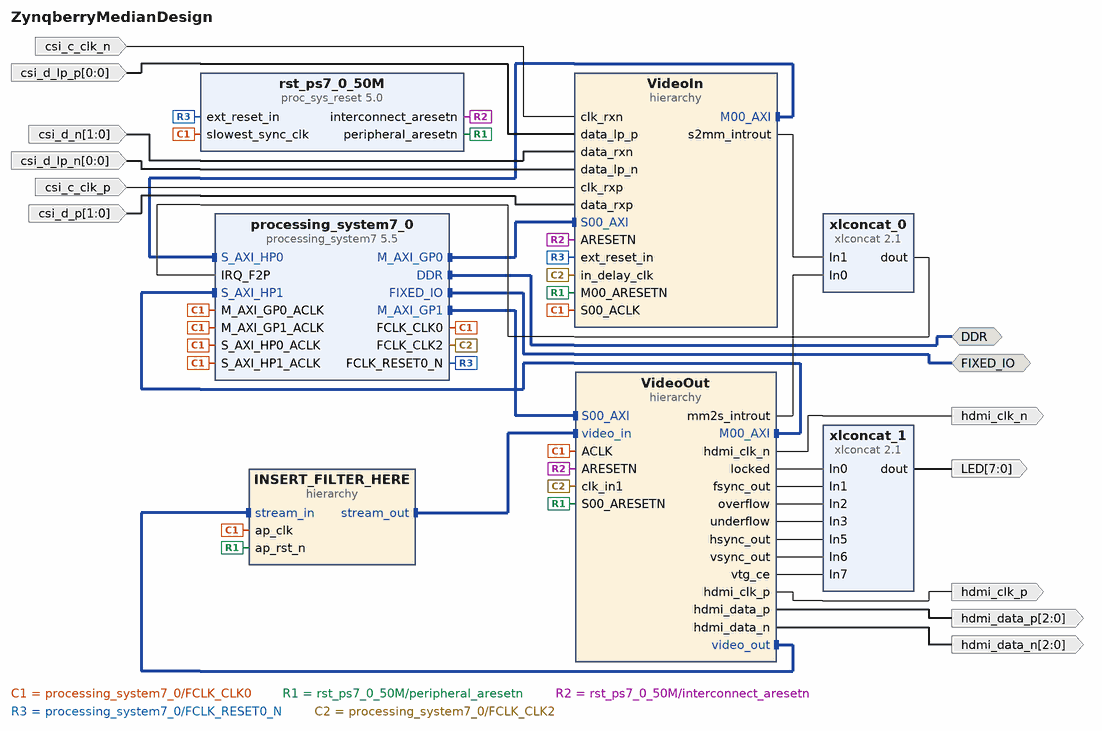
[diagram p0: block diagram of the top level]
# Vivado block design ZynqberryMedianDesign, xc7z010clg225-1, Vivado 2017.2
create_bd_design ZynqberryMedianDesign

create_bd_intf_port -mode Master -vlnv xilinx.com:interface:ddrx_rtl:1.0 DDR
create_bd_intf_port -mode Master -vlnv xilinx.com:display_processing_system7:fixedio_rtl:1.0 FIXED_IO
create_bd_port -dir O -from 2 -to 0 hdmi_data_p
create_bd_port -dir O hdmi_clk_p
create_bd_port -dir O hdmi_clk_n
create_bd_port -dir O -from 2 -to 0 hdmi_data_n
create_bd_port -dir O -from 7 -to 0 LED
create_bd_port -dir I csi_c_clk_n
create_bd_port -dir I -from 0 -to 0 csi_d_lp_p
create_bd_port -dir I -from 1 -to 0 csi_d_n
create_bd_port -dir I -from 0 -to 0 csi_d_lp_n
create_bd_port -dir I csi_c_clk_p
create_bd_port -dir I -from 1 -to 0 csi_d_p

create_bd_cell -type ip -vlnv xilinx.com:ip:processing_system7:5.5 processing_system7_0
set_property -dict [list \
  CONFIG.PCW_FCLK_CLK1_BUF TRUE \
  CONFIG.PCW_SDIO_PERIPHERAL_FREQMHZ 50 \
  CONFIG.PCW_I2C_PERIPHERAL_FREQMHZ 111.111115 \
  CONFIG.PCW_FPGA0_PERIPHERAL_FREQMHZ 150 \
  CONFIG.PCW_FPGA1_PERIPHERAL_FREQMHZ 100 \
  CONFIG.PCW_FPGA2_PERIPHERAL_FREQMHZ 200 \
  CONFIG.PCW_USE_M_AXI_GP1 1 \
  CONFIG.PCW_USE_S_AXI_HP0 1 \
  CONFIG.PCW_USE_S_AXI_HP1 1 \
  CONFIG.PCW_USE_FABRIC_INTERRUPT 1 \
  CONFIG.PCW_S_AXI_HP0_DATA_WIDTH 32 \
  CONFIG.PCW_S_AXI_HP1_DATA_WIDTH 32 \
  CONFIG.PCW_DQ_WIDTH 16 \
  CONFIG.PCW_DQS_WIDTH 2 \
  CONFIG.PCW_DM_WIDTH 2 \
  CONFIG.PCW_MIO_PRIMITIVE 32 \
  CONFIG.PCW_EN_CLK1_PORT 1 \
  CONFIG.PCW_EN_CLK2_PORT 1 \
  CONFIG.PCW_IRQ_F2P_INTR 1 \
  CONFIG.PCW_UIPARAM_DDR_MEMORY_TYPE {DDR 3 (Low Voltage)} \
  CONFIG.PCW_UIPARAM_DDR_BUS_WIDTH {16 Bit} \
  CONFIG.PCW_UIPARAM_DDR_PARTNO {MT41J256M16 RE-125} \
  CONFIG.PCW_QSPI_PERIPHERAL_ENABLE 1 \
  CONFIG.PCW_QSPI_QSPI_IO {MIO 1 .. 6} \
  CONFIG.PCW_QSPI_GRP_SINGLE_SS_ENABLE 1 \
  CONFIG.PCW_QSPI_GRP_SINGLE_SS_IO {MIO 1 .. 6} \
  CONFIG.PCW_SD1_PERIPHERAL_ENABLE 1 \
  CONFIG.PCW_SD1_SD1_IO {MIO 10 .. 15} \
  CONFIG.PCW_SD1_GRP_CD_ENABLE 1 \
  CONFIG.PCW_SD1_GRP_CD_IO {MIO 0} \
  CONFIG.PCW_UART1_PERIPHERAL_ENABLE 1 \
  CONFIG.PCW_UART1_UART1_IO {MIO 8 .. 9} \
  CONFIG.PCW_TTC0_PERIPHERAL_ENABLE 1 \
  CONFIG.PCW_TTC0_TTC0_IO EMIO \
  CONFIG.PCW_USB0_PERIPHERAL_ENABLE 1 \
  CONFIG.PCW_USB0_USB0_IO {MIO 28 .. 39} \
  CONFIG.PCW_USB_RESET_ENABLE 1 \
  CONFIG.PCW_USB_RESET_SELECT {Share reset pin} \
  CONFIG.PCW_USB0_RESET_ENABLE 1 \
  CONFIG.PCW_USB0_RESET_IO {MIO 7} \
  CONFIG.PCW_I2C1_PERIPHERAL_ENABLE 1 \
  CONFIG.PCW_I2C1_I2C1_IO {MIO 48 .. 49} \
  CONFIG.PCW_I2C1_GRP_INT_ENABLE 1 \
  CONFIG.PCW_I2C1_GRP_INT_IO EMIO \
  CONFIG.PCW_I2C_RESET_ENABLE 1 \
  CONFIG.PCW_I2C_RESET_SELECT {Share reset pin} \
  CONFIG.PCW_GPIO_MIO_GPIO_ENABLE 1 \
  CONFIG.PCW_GPIO_MIO_GPIO_IO MIO \
  CONFIG.PCW_ENET0_PERIPHERAL_CLKSRC External \
  CONFIG.PCW_UIPARAM_GENERATE_SUMMARY NONE \
  CONFIG.PCW_FPGA_FCLK1_ENABLE 1 \
] [get_bd_cells processing_system7_0]
# 142 more settings of processing_system7_0 are not shown: defaults, MIO pin electricals, DDR timing, and values the tool derives
create_bd_cell -type ip -vlnv xilinx.com:ip:proc_sys_reset:5.0 rst_ps7_0_50M
create_bd_cell -type hier VideoOut
create_bd_cell -type ip -vlnv xilinx.com:ip:xlconcat:2.1 xlconcat_0
set_property -dict {CONFIG.NUM_PORTS 2} [get_bd_cells xlconcat_0]
create_bd_cell -type ip -vlnv xilinx.com:ip:xlconcat:2.1 xlconcat_1
set_property -dict {CONFIG.NUM_PORTS 8} [get_bd_cells xlconcat_1]
create_bd_cell -type hier VideoIn
create_bd_cell -type hier INSERT_FILTER_HERE

# ---- hierarchy /VideoOut ----
current_bd_instance /VideoOut
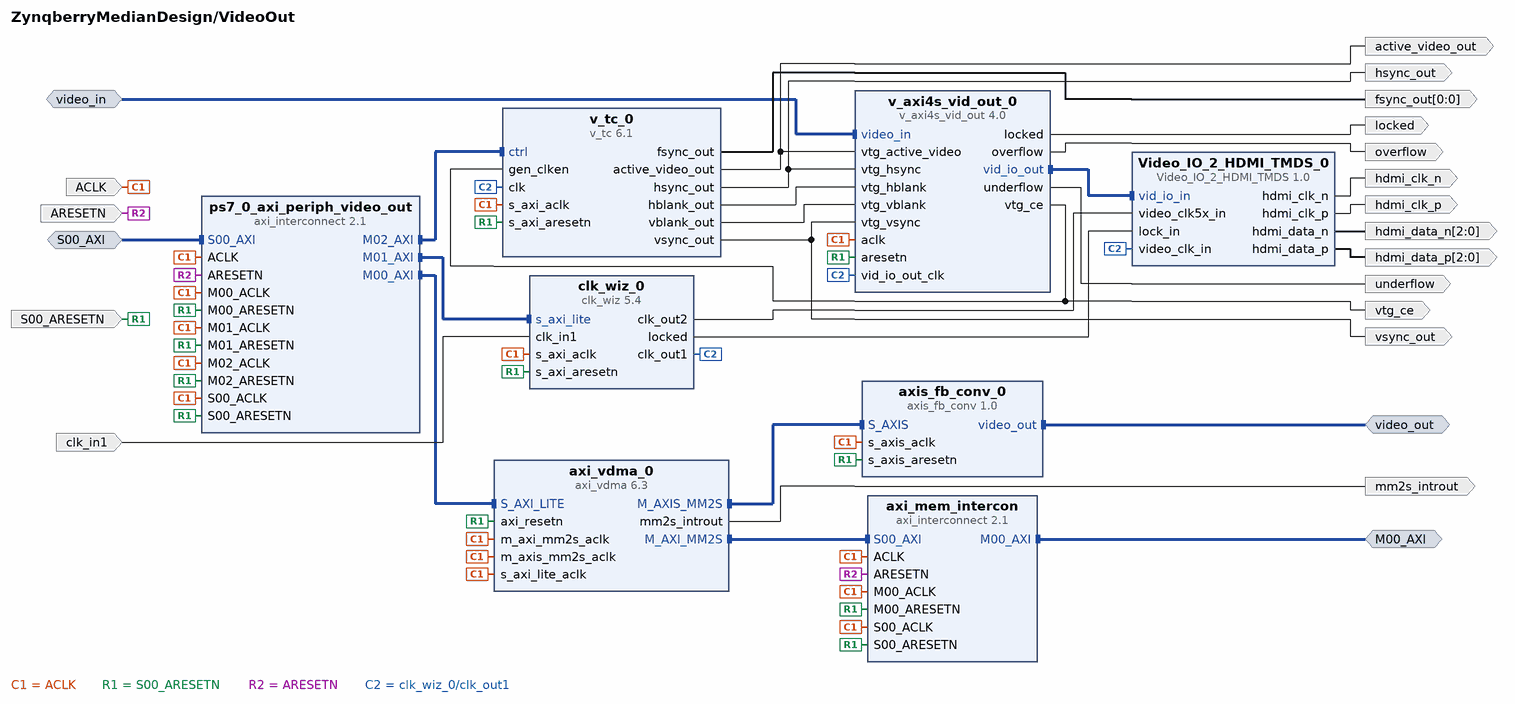
[diagram p1: block diagram inside /VideoOut]
create_bd_intf_pin -mode Slave -vlnv xilinx.com:interface:aximm_rtl:1.0 S00_AXI
create_bd_intf_pin -mode Master -vlnv xilinx.com:interface:aximm_rtl:1.0 M00_AXI
create_bd_intf_pin -mode Slave -vlnv xilinx.com:interface:axis_rtl:1.0 video_in
create_bd_intf_pin -mode Master -vlnv xilinx.com:interface:axis_rtl:1.0 video_out
create_bd_pin -dir I -type clk ACLK
create_bd_pin -dir I -type rst S00_ARESETN
create_bd_pin -dir I -type rst ARESETN
create_bd_pin -dir I -type clk clk_in1
create_bd_pin -dir O -type intr mm2s_introut
create_bd_pin -dir O -from 2 -to 0 hdmi_data_p
create_bd_pin -dir O hdmi_clk_p
create_bd_pin -dir O hdmi_clk_n
create_bd_pin -dir O -from 2 -to 0 hdmi_data_n
create_bd_pin -dir O locked
create_bd_pin -dir O -from 0 -to 0 fsync_out
create_bd_pin -dir O overflow
create_bd_pin -dir O underflow
create_bd_pin -dir O active_video_out
create_bd_pin -dir O hsync_out
create_bd_pin -dir O vsync_out
create_bd_pin -dir O vtg_ce

create_bd_cell -type ip -vlnv xilinx.com:ip:axi_vdma:6.3 axi_vdma_0
set_property -dict [list \
  CONFIG.c_m_axi_mm2s_data_width 32 \
  CONFIG.c_num_fstores 1 \
  CONFIG.c_mm2s_genlock_mode 0 \
  CONFIG.c_mm2s_linebuffer_depth 4096 \
  CONFIG.c_mm2s_max_burst_length 16 \
  CONFIG.c_include_s2mm 0 \
] [get_bd_cells axi_vdma_0]
create_bd_cell -type ip -vlnv xilinx.com:ip:axi_interconnect:2.1 axi_mem_intercon
set_property -dict {CONFIG.NUM_SI 1 CONFIG.NUM_MI 1 CONFIG.ENABLE_ADVANCED_OPTIONS 0} [get_bd_cells axi_mem_intercon]
create_bd_cell -type ip -vlnv xilinx.com:ip:axi_interconnect:2.1 ps7_0_axi_periph_video_out
set_property -dict {CONFIG.NUM_MI 3} [get_bd_cells ps7_0_axi_periph_video_out]
create_bd_cell -type ip -vlnv xilinx.com:ip:clk_wiz:5.4 clk_wiz_0
set_property -dict [list \
  CONFIG.USE_DYN_RECONFIG true \
  CONFIG.JITTER_SEL Min_O_Jitter \
  CONFIG.PRIM_IN_FREQ 200.000 \
  CONFIG.CLKIN1_JITTER_PS 50.0 \
  CONFIG.CLKOUT2_USED true \
  CONFIG.NUM_OUT_CLKS 2 \
  CONFIG.CLKOUT1_REQUESTED_OUT_FREQ 74.250 \
  CONFIG.CLKOUT2_REQUESTED_OUT_FREQ 371.250 \
  CONFIG.MMCM_DIVCLK_DIVIDE 10 \
  CONFIG.MMCM_BANDWIDTH HIGH \
  CONFIG.MMCM_CLKFBOUT_MULT_F 37.125 \
  CONFIG.MMCM_CLKIN1_PERIOD 5.000 \
  CONFIG.MMCM_CLKIN2_PERIOD 10.0 \
  CONFIG.MMCM_CLKOUT0_DIVIDE_F 10.000 \
  CONFIG.MMCM_CLKOUT1_DIVIDE 2 \
  CONFIG.CLKOUT1_JITTER 333.287 \
  CONFIG.CLKOUT1_PHASE_ERROR 322.999 \
  CONFIG.CLKOUT2_JITTER 256.477 \
  CONFIG.CLKOUT2_PHASE_ERROR 322.999 \
] [get_bd_cells clk_wiz_0]
create_bd_cell -type ip -vlnv xilinx.com:ip:v_tc:6.1 v_tc_0
set_property -dict {CONFIG.max_lines_per_frame 2048 CONFIG.enable_detection false} [get_bd_cells v_tc_0]
create_bd_cell -type ip -vlnv xilinx.com:ip:v_axi4s_vid_out:4.0 v_axi4s_vid_out_0
set_property -dict {CONFIG.C_HAS_ASYNC_CLK 1} [get_bd_cells v_axi4s_vid_out_0]
create_bd_cell -type ip -vlnv trenz.biz:user:Video_IO_2_HDMI_TMDS:1.0 Video_IO_2_HDMI_TMDS_0
set_property -dict [list \
  CONFIG.C_CLK_SWAP true \
  CONFIG.C_D0_SWAP true \
  CONFIG.C_INT_CLOCKING false \
] [get_bd_cells Video_IO_2_HDMI_TMDS_0]
create_bd_cell -type ip -vlnv trenz.biz:user:axis_fb_conv:1.0 axis_fb_conv_0

# ---- hierarchy /VideoIn ----
current_bd_instance /VideoIn
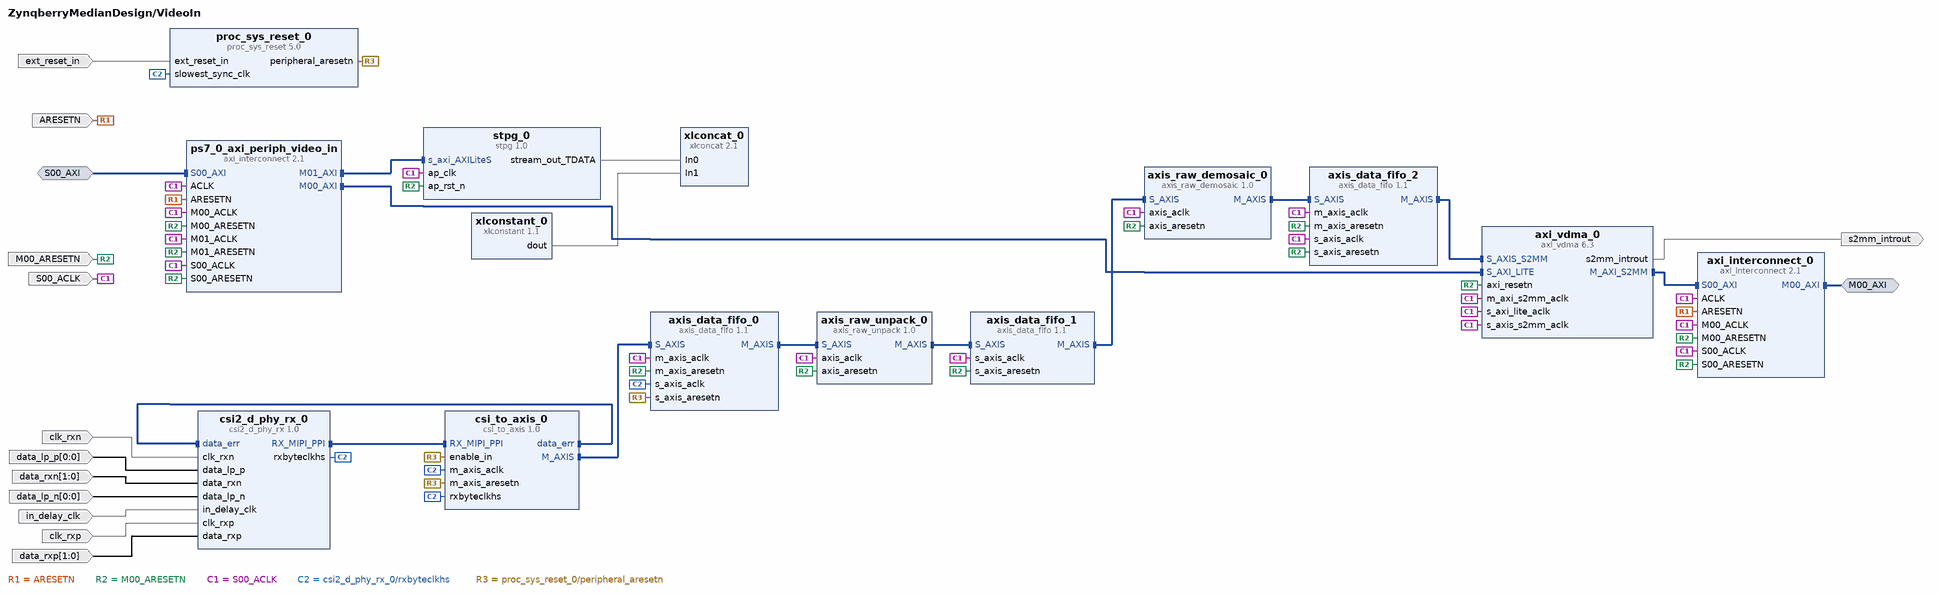
[diagram p2: block diagram inside /VideoIn]
create_bd_intf_pin -mode Slave -vlnv xilinx.com:interface:aximm_rtl:1.0 S00_AXI
create_bd_intf_pin -mode Master -vlnv xilinx.com:interface:aximm_rtl:1.0 M00_AXI
create_bd_pin -dir I -type rst ARESETN
create_bd_pin -dir I -type rst M00_ARESETN
create_bd_pin -dir I -type clk S00_ACLK
create_bd_pin -dir O -type intr s2mm_introut
create_bd_pin -dir I clk_rxn
create_bd_pin -dir I -from 0 -to 0 data_lp_p
create_bd_pin -dir I -from 1 -to 0 data_rxn
create_bd_pin -dir I -from 0 -to 0 data_lp_n
create_bd_pin -dir I -type clk in_delay_clk
create_bd_pin -dir I clk_rxp
create_bd_pin -dir I -from 1 -to 0 data_rxp
create_bd_pin -dir I -type rst ext_reset_in

create_bd_cell -type ip -vlnv xilinx.com:ip:axi_interconnect:2.1 ps7_0_axi_periph_video_in
set_property -dict {CONFIG.NUM_MI 2 CONFIG.ENABLE_ADVANCED_OPTIONS 0} [get_bd_cells ps7_0_axi_periph_video_in]
create_bd_cell -type ip -vlnv xilinx.com:ip:axi_vdma:6.3 axi_vdma_0
set_property -dict [list \
  CONFIG.c_include_s2mm_dre 1 \
  CONFIG.c_num_fstores 1 \
  CONFIG.c_use_s2mm_fsync 2 \
  CONFIG.c_s2mm_genlock_mode 0 \
  CONFIG.c_s2mm_linebuffer_depth 2048 \
  CONFIG.c_include_mm2s 0 \
  CONFIG.c_s2mm_max_burst_length 16 \
] [get_bd_cells axi_vdma_0]
create_bd_cell -type ip -vlnv xilinx.com:ip:axi_interconnect:2.1 axi_interconnect_0
set_property -dict {CONFIG.NUM_MI 1 CONFIG.ENABLE_ADVANCED_OPTIONS 0} [get_bd_cells axi_interconnect_0]
create_bd_cell -type ip -vlnv trenz.biz:user:csi2_d_phy_rx:1.0 csi2_d_phy_rx_0
set_property -dict {CONFIG.C_ADD_IDELAYCTRL true CONFIG.C_CALIB_WAIT 8191 CONFIG.C_RATE_LIMIT 50} [get_bd_cells csi2_d_phy_rx_0]
create_bd_cell -type ip -vlnv trenz.biz:user:csi_to_axis:1.0 csi_to_axis_0
set_property -dict {CONFIG.C_TIMEOUT 255} [get_bd_cells csi_to_axis_0]
create_bd_cell -type ip -vlnv xilinx.com:ip:proc_sys_reset:5.0 proc_sys_reset_0
create_bd_cell -type ip -vlnv xilinx.com:ip:axis_data_fifo:1.1 axis_data_fifo_0
set_property -dict [list \
  CONFIG.TDATA_NUM_BYTES 2 \
  CONFIG.TUSER_WIDTH 1 \
  CONFIG.FIFO_DEPTH 16384 \
  CONFIG.IS_ACLK_ASYNC 1 \
  CONFIG.HAS_TLAST 1 \
] [get_bd_cells axis_data_fifo_0]
create_bd_cell -type ip -vlnv trenz.biz:user:axis_raw_unpack:1.0 axis_raw_unpack_0
set_property -dict {CONFIG.C_IMP_TYPE 1 CONFIG.C_OUT_TYPE 1} [get_bd_cells axis_raw_unpack_0]
create_bd_cell -type ip -vlnv xilinx.com:ip:axis_data_fifo:1.1 axis_data_fifo_1
create_bd_cell -type ip -vlnv trenz.biz:user:axis_raw_demosaic:1.0 axis_raw_demosaic_0
set_property -dict {CONFIG.C_RAW_WIDTH 10 CONFIG.C_MODE 1 CONFIG.C_COLOR_POS 1} [get_bd_cells axis_raw_demosaic_0]
create_bd_cell -type ip -vlnv xilinx.com:ip:axis_data_fifo:1.1 axis_data_fifo_2
set_property -dict {CONFIG.FIFO_DEPTH 4096 CONFIG.IS_ACLK_ASYNC 1} [get_bd_cells axis_data_fifo_2]
create_bd_cell -type ip -vlnv MicroelectronicSystemsDesignResearchGroup:median.demonstrator:stpg:1.0 stpg_0
create_bd_cell -type ip -vlnv xilinx.com:ip:xlconstant:1.1 xlconstant_0
set_property -dict {CONFIG.CONST_WIDTH 8 CONFIG.CONST_VAL 0} [get_bd_cells xlconstant_0]
create_bd_cell -type ip -vlnv xilinx.com:ip:xlconcat:2.1 xlconcat_0

# ---- hierarchy /INSERT_FILTER_HERE ----
current_bd_instance /INSERT_FILTER_HERE
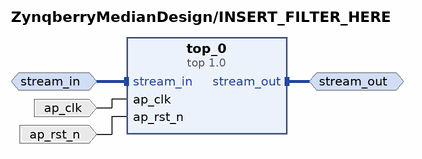
[diagram p3: block diagram inside /INSERT_FILTER_HERE]
create_bd_intf_pin -mode Slave -vlnv xilinx.com:interface:axis_rtl:1.0 stream_in
create_bd_intf_pin -mode Master -vlnv xilinx.com:interface:axis_rtl:1.0 stream_out
create_bd_pin -dir I -type clk ap_clk
create_bd_pin -dir I -type rst ap_rst_n

create_bd_cell -type ip -vlnv JohannesFeldmann:hls:top:1.0 top_0

# ---- connections ----

current_bd_instance /VideoOut
connect_bd_intf_net [get_bd_intf_pins axi_vdma_0/M_AXI_MM2S] [get_bd_intf_pins axi_mem_intercon/S00_AXI]
connect_bd_intf_net [get_bd_intf_pins axi_vdma_0/S_AXI_LITE] [get_bd_intf_pins ps7_0_axi_periph_video_out/M00_AXI]
connect_bd_intf_net [get_bd_intf_pins ps7_0_axi_periph_video_out/M01_AXI] [get_bd_intf_pins clk_wiz_0/s_axi_lite]
connect_bd_intf_net [get_bd_intf_pins ps7_0_axi_periph_video_out/M02_AXI] [get_bd_intf_pins v_tc_0/ctrl]
connect_bd_intf_net [get_bd_intf_pins v_axi4s_vid_out_0/vid_io_out] [get_bd_intf_pins Video_IO_2_HDMI_TMDS_0/vid_io_in]
connect_bd_intf_net [get_bd_intf_pins axis_fb_conv_0/S_AXIS] [get_bd_intf_pins axi_vdma_0/M_AXIS_MM2S]
connect_bd_intf_net [get_bd_intf_pins S00_AXI] [get_bd_intf_pins ps7_0_axi_periph_video_out/S00_AXI]
connect_bd_intf_net [get_bd_intf_pins M00_AXI] [get_bd_intf_pins axi_mem_intercon/M00_AXI]
connect_bd_intf_net [get_bd_intf_pins video_in] [get_bd_intf_pins v_axi4s_vid_out_0/video_in]
connect_bd_intf_net [get_bd_intf_pins video_out] [get_bd_intf_pins axis_fb_conv_0/video_out]
connect_bd_net [get_bd_pins ACLK] \
  [get_bd_pins axi_vdma_0/m_axi_mm2s_aclk] [get_bd_pins axi_vdma_0/s_axi_lite_aclk] [get_bd_pins clk_wiz_0/s_axi_aclk] \
  [get_bd_pins v_tc_0/s_axi_aclk] [get_bd_pins v_axi4s_vid_out_0/aclk] [get_bd_pins axi_vdma_0/m_axis_mm2s_aclk] \
  [get_bd_pins axis_fb_conv_0/s_axis_aclk] [get_bd_pins axi_mem_intercon/ACLK] [get_bd_pins axi_mem_intercon/S00_ACLK] \
  [get_bd_pins axi_mem_intercon/M00_ACLK] [get_bd_pins ps7_0_axi_periph_video_out/S00_ACLK] \
  [get_bd_pins ps7_0_axi_periph_video_out/M00_ACLK] [get_bd_pins ps7_0_axi_periph_video_out/ACLK] \
  [get_bd_pins ps7_0_axi_periph_video_out/M01_ACLK] [get_bd_pins ps7_0_axi_periph_video_out/M02_ACLK]
connect_bd_net [get_bd_pins S00_ARESETN] \
  [get_bd_pins axi_vdma_0/axi_resetn] [get_bd_pins v_tc_0/s_axi_aresetn] [get_bd_pins v_axi4s_vid_out_0/aresetn] \
  [get_bd_pins axis_fb_conv_0/s_axis_aresetn] [get_bd_pins clk_wiz_0/s_axi_aresetn] \
  [get_bd_pins axi_mem_intercon/S00_ARESETN] [get_bd_pins axi_mem_intercon/M00_ARESETN] \
  [get_bd_pins ps7_0_axi_periph_video_out/M00_ARESETN] [get_bd_pins ps7_0_axi_periph_video_out/S00_ARESETN] \
  [get_bd_pins ps7_0_axi_periph_video_out/M01_ARESETN] [get_bd_pins ps7_0_axi_periph_video_out/M02_ARESETN]
connect_bd_net [get_bd_pins ARESETN] [get_bd_pins axi_mem_intercon/ARESETN] [get_bd_pins ps7_0_axi_periph_video_out/ARESETN]
connect_bd_net -net clk_in1_1 [get_bd_pins clk_in1] [get_bd_pins clk_wiz_0/clk_in1]
connect_bd_net [get_bd_pins clk_wiz_0/clk_out1] \
  [get_bd_pins v_tc_0/clk] [get_bd_pins v_axi4s_vid_out_0/vid_io_out_clk] [get_bd_pins Video_IO_2_HDMI_TMDS_0/video_clk_in]
connect_bd_net [get_bd_pins v_axi4s_vid_out_0/vtg_ce] [get_bd_pins vtg_ce] [get_bd_pins v_tc_0/gen_clken]
connect_bd_net [get_bd_pins axi_vdma_0/mm2s_introut] [get_bd_pins mm2s_introut]
connect_bd_net [get_bd_pins clk_wiz_0/clk_out2] [get_bd_pins Video_IO_2_HDMI_TMDS_0/video_clk5x_in]
connect_bd_net [get_bd_pins clk_wiz_0/locked] [get_bd_pins Video_IO_2_HDMI_TMDS_0/lock_in]
connect_bd_net [get_bd_pins Video_IO_2_HDMI_TMDS_0/hdmi_data_p] [get_bd_pins hdmi_data_p]
connect_bd_net [get_bd_pins Video_IO_2_HDMI_TMDS_0/hdmi_clk_p] [get_bd_pins hdmi_clk_p]
connect_bd_net [get_bd_pins Video_IO_2_HDMI_TMDS_0/hdmi_clk_n] [get_bd_pins hdmi_clk_n]
connect_bd_net [get_bd_pins Video_IO_2_HDMI_TMDS_0/hdmi_data_n] [get_bd_pins hdmi_data_n]
connect_bd_net [get_bd_pins v_axi4s_vid_out_0/locked] [get_bd_pins locked]
connect_bd_net [get_bd_pins v_tc_0/fsync_out] [get_bd_pins fsync_out]
connect_bd_net [get_bd_pins v_axi4s_vid_out_0/overflow] [get_bd_pins overflow]
connect_bd_net [get_bd_pins v_axi4s_vid_out_0/underflow] [get_bd_pins underflow]
connect_bd_net [get_bd_pins v_tc_0/active_video_out] [get_bd_pins active_video_out] [get_bd_pins v_axi4s_vid_out_0/vtg_active_video]
connect_bd_net [get_bd_pins v_tc_0/hsync_out] [get_bd_pins hsync_out] [get_bd_pins v_axi4s_vid_out_0/vtg_hsync]
connect_bd_net [get_bd_pins v_tc_0/vsync_out] [get_bd_pins vsync_out] [get_bd_pins v_axi4s_vid_out_0/vtg_vsync]
connect_bd_net [get_bd_pins v_tc_0/hblank_out] [get_bd_pins v_axi4s_vid_out_0/vtg_hblank]
connect_bd_net [get_bd_pins v_tc_0/vblank_out] [get_bd_pins v_axi4s_vid_out_0/vtg_vblank]

current_bd_instance /VideoIn
connect_bd_intf_net [get_bd_intf_pins ps7_0_axi_periph_video_in/M00_AXI] [get_bd_intf_pins axi_vdma_0/S_AXI_LITE]
connect_bd_intf_net [get_bd_intf_pins csi2_d_phy_rx_0/RX_MIPI_PPI] [get_bd_intf_pins csi_to_axis_0/RX_MIPI_PPI]
connect_bd_intf_net [get_bd_intf_pins csi_to_axis_0/data_err] [get_bd_intf_pins csi2_d_phy_rx_0/data_err]
connect_bd_intf_net [get_bd_intf_pins axis_data_fifo_0/S_AXIS] [get_bd_intf_pins csi_to_axis_0/M_AXIS]
connect_bd_intf_net [get_bd_intf_pins axis_raw_unpack_0/S_AXIS] [get_bd_intf_pins axis_data_fifo_0/M_AXIS]
connect_bd_intf_net [get_bd_intf_pins axis_raw_unpack_0/M_AXIS] [get_bd_intf_pins axis_data_fifo_1/S_AXIS]
connect_bd_intf_net [get_bd_intf_pins axis_data_fifo_1/M_AXIS] [get_bd_intf_pins axis_raw_demosaic_0/S_AXIS]
connect_bd_intf_net [get_bd_intf_pins axis_data_fifo_2/S_AXIS] [get_bd_intf_pins axis_raw_demosaic_0/M_AXIS]
connect_bd_intf_net [get_bd_intf_pins ps7_0_axi_periph_video_in/M01_AXI] [get_bd_intf_pins stpg_0/s_axi_AXILiteS]
connect_bd_intf_net [get_bd_intf_pins axi_vdma_0/M_AXI_S2MM] [get_bd_intf_pins axi_interconnect_0/S00_AXI]
connect_bd_intf_net [get_bd_intf_pins axi_vdma_0/S_AXIS_S2MM] [get_bd_intf_pins axis_data_fifo_2/M_AXIS]
connect_bd_intf_net [get_bd_intf_pins S00_AXI] [get_bd_intf_pins ps7_0_axi_periph_video_in/S00_AXI]
connect_bd_intf_net [get_bd_intf_pins M00_AXI] [get_bd_intf_pins axi_interconnect_0/M00_AXI]
connect_bd_net [get_bd_pins ARESETN] [get_bd_pins ps7_0_axi_periph_video_in/ARESETN] [get_bd_pins axi_interconnect_0/ARESETN]
connect_bd_net [get_bd_pins M00_ARESETN] \
  [get_bd_pins axi_vdma_0/axi_resetn] [get_bd_pins axis_raw_unpack_0/axis_aresetn] \
  [get_bd_pins axis_data_fifo_0/m_axis_aresetn] [get_bd_pins axis_data_fifo_1/s_axis_aresetn] \
  [get_bd_pins axis_raw_demosaic_0/axis_aresetn] [get_bd_pins axis_data_fifo_2/m_axis_aresetn] \
  [get_bd_pins axis_data_fifo_2/s_axis_aresetn] [get_bd_pins stpg_0/ap_rst_n] \
  [get_bd_pins ps7_0_axi_periph_video_in/M00_ARESETN] [get_bd_pins ps7_0_axi_periph_video_in/S00_ARESETN] \
  [get_bd_pins axi_interconnect_0/M00_ARESETN] [get_bd_pins axi_interconnect_0/S00_ARESETN] \
  [get_bd_pins ps7_0_axi_periph_video_in/M01_ARESETN]
connect_bd_net [get_bd_pins S00_ACLK] \
  [get_bd_pins axi_vdma_0/s_axi_lite_aclk] [get_bd_pins axi_vdma_0/s_axis_s2mm_aclk] [get_bd_pins axi_vdma_0/m_axi_s2mm_aclk] \
  [get_bd_pins axis_data_fifo_0/m_axis_aclk] [get_bd_pins axis_raw_unpack_0/axis_aclk] \
  [get_bd_pins axis_data_fifo_1/s_axis_aclk] [get_bd_pins axis_raw_demosaic_0/axis_aclk] \
  [get_bd_pins axis_data_fifo_2/s_axis_aclk] [get_bd_pins axis_data_fifo_2/m_axis_aclk] [get_bd_pins stpg_0/ap_clk] \
  [get_bd_pins ps7_0_axi_periph_video_in/S00_ACLK] [get_bd_pins ps7_0_axi_periph_video_in/M00_ACLK] \
  [get_bd_pins ps7_0_axi_periph_video_in/ACLK] [get_bd_pins axi_interconnect_0/ACLK] \
  [get_bd_pins axi_interconnect_0/S00_ACLK] [get_bd_pins axi_interconnect_0/M00_ACLK] \
  [get_bd_pins ps7_0_axi_periph_video_in/M01_ACLK]
connect_bd_net [get_bd_pins axi_vdma_0/s2mm_introut] [get_bd_pins s2mm_introut]
connect_bd_net [get_bd_pins clk_rxn] [get_bd_pins csi2_d_phy_rx_0/clk_rxn]
connect_bd_net [get_bd_pins data_lp_p] [get_bd_pins csi2_d_phy_rx_0/data_lp_p]
connect_bd_net [get_bd_pins data_rxn] [get_bd_pins csi2_d_phy_rx_0/data_rxn]
connect_bd_net [get_bd_pins data_lp_n] [get_bd_pins csi2_d_phy_rx_0/data_lp_n]
connect_bd_net [get_bd_pins in_delay_clk] [get_bd_pins csi2_d_phy_rx_0/in_delay_clk]
connect_bd_net [get_bd_pins clk_rxp] [get_bd_pins csi2_d_phy_rx_0/clk_rxp]
connect_bd_net [get_bd_pins data_rxp] [get_bd_pins csi2_d_phy_rx_0/data_rxp]
connect_bd_net [get_bd_pins csi2_d_phy_rx_0/rxbyteclkhs] \
  [get_bd_pins csi_to_axis_0/rxbyteclkhs] [get_bd_pins csi_to_axis_0/m_axis_aclk] \
  [get_bd_pins proc_sys_reset_0/slowest_sync_clk] [get_bd_pins axis_data_fifo_0/s_axis_aclk]
connect_bd_net [get_bd_pins ext_reset_in] [get_bd_pins proc_sys_reset_0/ext_reset_in]
connect_bd_net [get_bd_pins proc_sys_reset_0/peripheral_aresetn] \
  [get_bd_pins csi_to_axis_0/m_axis_aresetn] [get_bd_pins axis_data_fifo_0/s_axis_aresetn] \
  [get_bd_pins csi_to_axis_0/enable_in]
connect_bd_net [get_bd_pins stpg_0/stream_out_TDATA] [get_bd_pins xlconcat_0/In0]
connect_bd_net [get_bd_pins xlconstant_0/dout] [get_bd_pins xlconcat_0/In1]

current_bd_instance /INSERT_FILTER_HERE
connect_bd_intf_net [get_bd_intf_pins stream_in] [get_bd_intf_pins top_0/stream_in]
connect_bd_intf_net [get_bd_intf_pins stream_out] [get_bd_intf_pins top_0/stream_out]
connect_bd_net [get_bd_pins ap_clk] [get_bd_pins top_0/ap_clk]
connect_bd_net [get_bd_pins ap_rst_n] [get_bd_pins top_0/ap_rst_n]

current_bd_instance /
connect_bd_intf_net [get_bd_intf_pins processing_system7_0/M_AXI_GP1] [get_bd_intf_pins VideoOut/S00_AXI]
connect_bd_intf_net [get_bd_intf_pins processing_system7_0/M_AXI_GP0] [get_bd_intf_pins VideoIn/S00_AXI]
connect_bd_intf_net [get_bd_intf_pins processing_system7_0/S_AXI_HP0] [get_bd_intf_pins VideoIn/M00_AXI]
connect_bd_intf_net [get_bd_intf_pins processing_system7_0/S_AXI_HP1] [get_bd_intf_pins VideoOut/M00_AXI]
connect_bd_intf_net [get_bd_intf_pins VideoOut/video_out] [get_bd_intf_pins INSERT_FILTER_HERE/stream_in]
connect_bd_intf_net [get_bd_intf_pins VideoOut/video_in] [get_bd_intf_pins INSERT_FILTER_HERE/stream_out]
connect_bd_intf_net [get_bd_intf_ports DDR] [get_bd_intf_pins processing_system7_0/DDR]
connect_bd_intf_net [get_bd_intf_ports FIXED_IO] [get_bd_intf_pins processing_system7_0/FIXED_IO]
connect_bd_net [get_bd_pins processing_system7_0/FCLK_CLK0] \
  [get_bd_pins rst_ps7_0_50M/slowest_sync_clk] [get_bd_pins processing_system7_0/M_AXI_GP0_ACLK] \
  [get_bd_pins processing_system7_0/S_AXI_HP0_ACLK] [get_bd_pins processing_system7_0/M_AXI_GP1_ACLK] \
  [get_bd_pins processing_system7_0/S_AXI_HP1_ACLK] [get_bd_pins VideoOut/ACLK] [get_bd_pins VideoIn/S00_ACLK] \
  [get_bd_pins INSERT_FILTER_HERE/ap_clk]
connect_bd_net [get_bd_pins rst_ps7_0_50M/peripheral_aresetn] \
  [get_bd_pins VideoOut/S00_ARESETN] [get_bd_pins VideoIn/M00_ARESETN] [get_bd_pins INSERT_FILTER_HERE/ap_rst_n]
connect_bd_net [get_bd_pins rst_ps7_0_50M/interconnect_aresetn] [get_bd_pins VideoOut/ARESETN] [get_bd_pins VideoIn/ARESETN]
connect_bd_net [get_bd_pins processing_system7_0/FCLK_RESET0_N] [get_bd_pins rst_ps7_0_50M/ext_reset_in] [get_bd_pins VideoIn/ext_reset_in]
connect_bd_net [get_bd_pins processing_system7_0/FCLK_CLK2] [get_bd_pins VideoOut/clk_in1] [get_bd_pins VideoIn/in_delay_clk]
connect_bd_net [get_bd_pins xlconcat_0/dout] [get_bd_pins processing_system7_0/IRQ_F2P]
connect_bd_net [get_bd_pins VideoOut/mm2s_introut] [get_bd_pins xlconcat_0/In0]
connect_bd_net [get_bd_pins VideoOut/hdmi_data_p] [get_bd_ports hdmi_data_p]
connect_bd_net [get_bd_pins VideoOut/hdmi_clk_p] [get_bd_ports hdmi_clk_p]
connect_bd_net [get_bd_pins VideoOut/hdmi_clk_n] [get_bd_ports hdmi_clk_n]
connect_bd_net [get_bd_pins VideoOut/hdmi_data_n] [get_bd_ports hdmi_data_n]
connect_bd_net [get_bd_pins xlconcat_1/dout] [get_bd_ports LED]
connect_bd_net [get_bd_pins VideoOut/locked] [get_bd_pins xlconcat_1/In0]
connect_bd_net [get_bd_pins VideoOut/fsync_out] [get_bd_pins xlconcat_1/In1]
connect_bd_net [get_bd_pins VideoOut/overflow] [get_bd_pins xlconcat_1/In2]
connect_bd_net [get_bd_pins VideoOut/underflow] [get_bd_pins xlconcat_1/In3]
connect_bd_net [get_bd_pins VideoOut/hsync_out] [get_bd_pins xlconcat_1/In5]
connect_bd_net [get_bd_pins VideoOut/vsync_out] [get_bd_pins xlconcat_1/In6]
connect_bd_net [get_bd_pins VideoOut/vtg_ce] [get_bd_pins xlconcat_1/In7]
connect_bd_net [get_bd_pins VideoIn/s2mm_introut] [get_bd_pins xlconcat_0/In1]
connect_bd_net [get_bd_ports csi_c_clk_n] [get_bd_pins VideoIn/clk_rxn]
connect_bd_net [get_bd_ports csi_d_lp_p] [get_bd_pins VideoIn/data_lp_p]
connect_bd_net [get_bd_ports csi_d_n] [get_bd_pins VideoIn/data_rxn]
connect_bd_net [get_bd_ports csi_d_lp_n] [get_bd_pins VideoIn/data_lp_n]
connect_bd_net [get_bd_ports csi_c_clk_p] [get_bd_pins VideoIn/clk_rxp]
connect_bd_net [get_bd_ports csi_d_p] [get_bd_pins VideoIn/data_rxp]

# ---- address map ----
assign_bd_address -offset 0x43000000 -range 64K -target_address_space [get_bd_addr_spaces processing_system7_0/Data] [get_bd_addr_segs VideoIn/axi_vdma_0/S_AXI_LITE/Reg]
assign_bd_address -offset 0x43C00000 -range 64K -target_address_space [get_bd_addr_spaces processing_system7_0/Data] [get_bd_addr_segs VideoIn/stpg_0/s_axi_AXILiteS/Reg]
assign_bd_address -offset 0x83000000 -range 64K -target_address_space [get_bd_addr_spaces processing_system7_0/Data] [get_bd_addr_segs VideoOut/axi_vdma_0/S_AXI_LITE/Reg]
assign_bd_address -offset 0x83C00000 -range 64K -target_address_space [get_bd_addr_spaces processing_system7_0/Data] [get_bd_addr_segs VideoOut/clk_wiz_0/s_axi_lite/Reg]
assign_bd_address -offset 0x83C10000 -range 64K -target_address_space [get_bd_addr_spaces processing_system7_0/Data] [get_bd_addr_segs VideoOut/v_tc_0/ctrl/Reg]
assign_bd_address -offset 0x00000000 -range 512M -target_address_space [get_bd_addr_spaces VideoIn/axi_vdma_0/Data_S2MM] [get_bd_addr_segs processing_system7_0/S_AXI_HP0/HP0_DDR_LOWOCM]
assign_bd_address -offset 0x00000000 -range 512M -target_address_space [get_bd_addr_spaces VideoOut/axi_vdma_0/Data_MM2S] [get_bd_addr_segs processing_system7_0/S_AXI_HP1/HP1_DDR_LOWOCM]

validate_bd_design
save_bd_design
